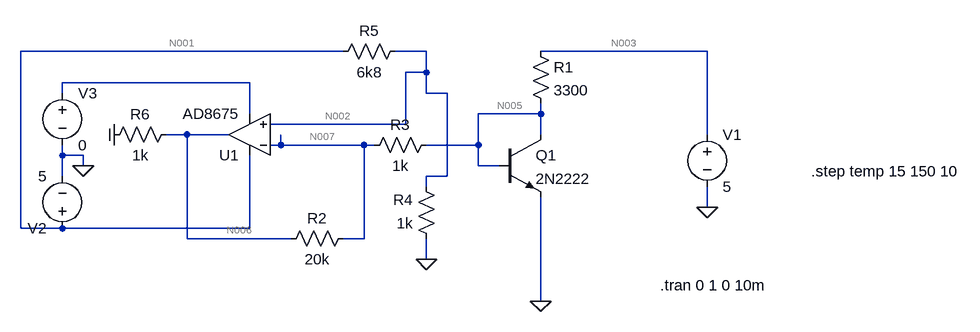
[diagram p0: schematic 2n2222-as-temp-inv.asc]
2n2222-as-temp-inv.asc, the LTspice schematic file:
Version 4
SHEET 1 1048 680
WIRE 80 16 -416 16
WIRE 208 16 160 16
WIRE 640 16 384 16
WIRE 208 48 208 16
WIRE 208 48 176 48
WIRE -64 64 -352 64
WIRE -352 80 -352 64
WIRE 208 80 208 48
WIRE 240 80 208 80
WIRE -64 112 -64 64
WIRE 384 112 384 96
WIRE 384 112 288 112
WIRE 176 128 176 48
WIRE 176 128 -32 128
WIRE -160 144 -192 144
WIRE -96 144 -160 144
WIRE 384 144 384 112
WIRE 640 144 640 16
WIRE -16 160 -16 144
WIRE -16 160 -32 160
WIRE 112 160 -16 160
WIRE 128 160 112 160
WIRE 288 160 288 112
WIRE 288 160 208 160
WIRE -352 176 -352 160
WIRE -320 176 -352 176
WIRE -320 192 -320 176
WIRE 288 192 288 160
WIRE 320 192 288 192
WIRE -352 208 -352 176
WIRE 240 208 240 80
WIRE 240 208 208 208
WIRE 208 224 208 208
WIRE 640 256 640 224
WIRE -416 288 -416 16
WIRE -352 288 -416 288
WIRE -64 288 -64 176
WIRE -64 288 -352 288
WIRE -160 304 -160 144
WIRE 0 304 -160 304
WIRE 112 304 112 160
WIRE 112 304 80 304
WIRE 208 336 208 304
WIRE 384 400 384 240
FLAG 384 400 0
FLAG 640 256 0
FLAG -320 192 0
FLAG -272 144 COM
IOPIN -272 144 In
FLAG 208 336 0
SYMBOL npn 320 144 R0
SYMATTR InstName Q1
SYMATTR Value 2N2222
SYMBOL voltage 640 128 R0
WINDOW 123 0 0 Left 0
WINDOW 39 0 0 Left 0
SYMATTR InstName V1
SYMATTR Value 5
SYMBOL res 368 0 R0
SYMATTR InstName R1
SYMATTR Value 3300
SYMBOL Opamps\\AD8675 -64 208 R180
SYMATTR InstName U1
SYMBOL voltage -352 304 R180
WINDOW 123 0 0 Left 0
WINDOW 39 0 0 Left 0
SYMATTR InstName V2
SYMATTR Value 5
SYMBOL voltage -352 64 R0
WINDOW 123 0 0 Left 0
WINDOW 39 0 0 Left 0
SYMATTR InstName V3
SYMATTR Value 0
SYMBOL res -176 128 R90
WINDOW 0 0 56 VBottom 2
WINDOW 3 32 56 VTop 2
SYMATTR InstName R6
SYMATTR Value 1k
SYMBOL res 224 144 R90
WINDOW 0 0 56 VBottom 2
WINDOW 3 32 56 VTop 2
SYMATTR InstName R3
SYMATTR Value 1k
SYMBOL res 96 288 R90
WINDOW 0 0 56 VBottom 2
WINDOW 3 32 56 VTop 2
SYMATTR InstName R2
SYMATTR Value 20k
SYMBOL res 224 320 R180
WINDOW 0 36 76 Left 2
WINDOW 3 36 40 Left 2
SYMATTR InstName R4
SYMATTR Value 1k
SYMBOL res 64 32 R270
WINDOW 0 32 56 VTop 2
WINDOW 3 0 56 VBottom 2
SYMATTR InstName R5
SYMATTR Value 6k8
TEXT 800 200 Left 2 !.step temp 15 150 10
TEXT 568 376 Left 2 !.tran 0 1 0 10m

The netlist it stands for:
* 2n2222-as-temp-inv.asc
Q1 N005 N005 0 0 2N2222
V1 N003 0 5
R1 N003 N005 3300
XU1 N002 N007 N001 N004 N006 AD8675  ; pins In+ In- V+ V- OUT
V2 N001 0 5
V3 N004 0 0
R6 N006 COM 1k
R3 N005 N007 1k
R2 N007 N006 20k
R4 0 N002 1k
R5 N001 N002 6k8
.model NPN NPN
.model PNP PNP
.lib standard.bjt
.step temp 15 150 10
.tran 0 1 0 10m
.backanno
.end

* Results of the author's LTspice run, read from the files saved beside the schematic
* Operating Point (first step), zero values left out:
*   temperature = 15 
*   V(n005) = 682.7 mV
*   V(n003) = 5 V
*   V(n001) = 5 V
*   V(n006) = -2.793 mV
*   V(com) = -2.793 mV
*   V(n007) = 650 mV
*   V(n002) = 641 mV
*   Ic(Q1) = 1.269 mA
*   Ib(Q1) = 6.773 µA
*   Ie(Q1) = -1.276 mA
*   I(R5) = 641 µA
*   I(R4) = -641 µA
*   I(R2) = 32.64 µA
*   I(R3) = 32.64 µA
*   I(R1) = 1.308 mA
*   I(V3) = 695 µA
*   I(V2) = -1.303 mA
*   I(V1) = -1.308 mA
*   Ix(u2:1) = 1.906 pA
*   Ix(u2:2) = 1.908 pA
*   Ix(u2:3) = 662.2 µA
*   Ix(u2:4) = -695 µA
*   Ix(u2:5) = 32.64 µA
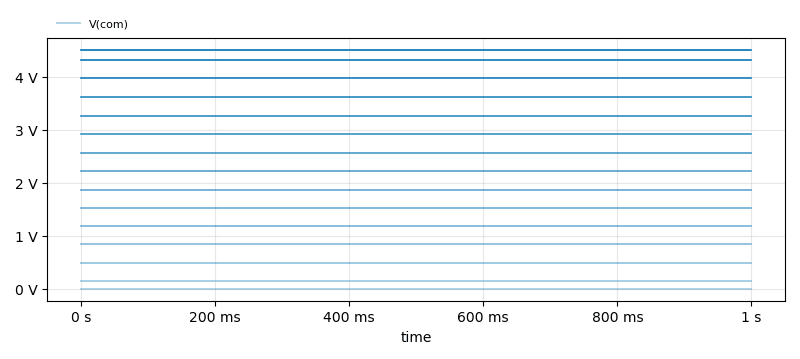
[diagram p1: Transient Analysis of 2n2222-as-temp-inv.asc, plotted from the saved traces]
* Transient Analysis, 15 runs:
*   V(com) [temp=15°C]: min -2.793 mV, max -2.793 mV, average -2.793 mV, rms 2.793 mV, last -2.793 mV
*   V(com) [temp=25°C]: min 151.7 mV, max 151.7 mV, average 151.7 mV, rms 151.7 mV, last 151.7 mV
*   V(com) [temp=35°C]: min 493.4 mV, max 493.4 mV, average 493.4 mV, rms 493.4 mV, last 493.4 mV
*   V(com) [temp=45°C]: min 836.2 mV, max 836.2 mV, average 836.2 mV, rms 836.2 mV, last 836.2 mV
*   V(com) [temp=55°C]: min 1.18 V, max 1.18 V, average 1.18 V, rms 1.18 V, last 1.18 V
*   V(com) [temp=65°C]: min 1.525 V, max 1.525 V, average 1.525 V, rms 1.525 V, last 1.525 V
*   V(com) [temp=75°C]: min 1.872 V, max 1.872 V, average 1.872 V, rms 1.872 V, last 1.872 V
*   V(com) [temp=85°C]: min 2.219 V, max 2.219 V, average 2.219 V, rms 2.219 V, last 2.219 V